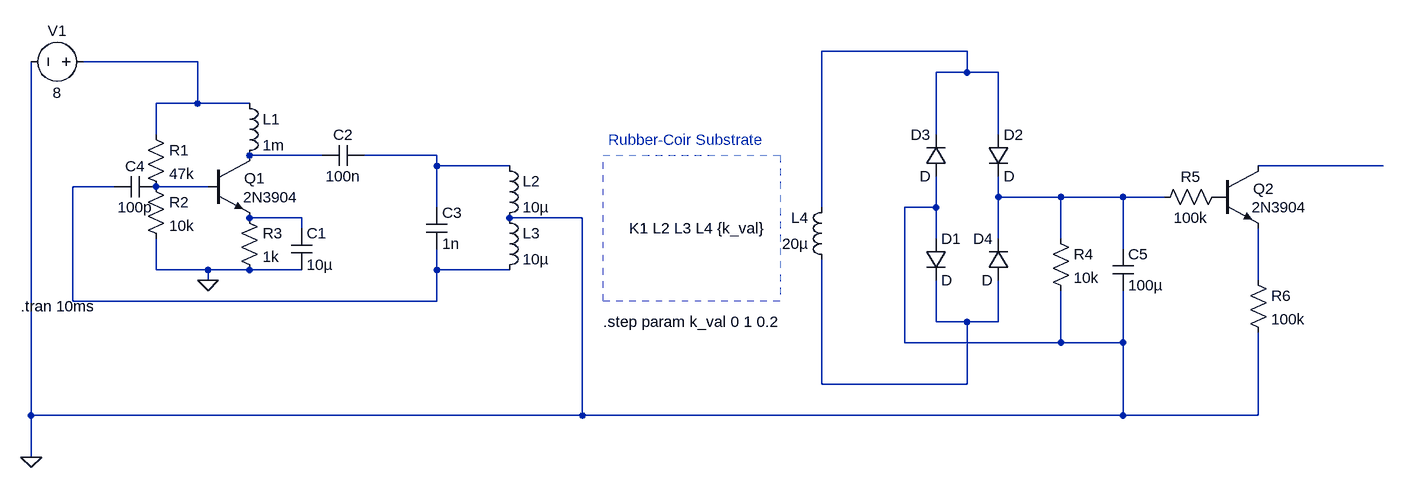
[diagram p0: schematic ecometa_bridge rect.asc]
ecometa_bridge rect.asc, the LTspice schematic file:
Version 4.1
SHEET 1 1652 680
WIRE 1008 -48 784 -48
WIRE -176 -32 -352 -32
WIRE 1008 -16 1008 -48
WIRE 1008 -16 960 -16
WIRE 1056 -16 1008 -16
WIRE -176 32 -176 -32
WIRE -176 32 -240 32
WIRE -96 32 -176 32
WIRE -240 80 -240 32
WIRE 960 80 960 -16
WIRE 1056 80 1056 -16
WIRE 16 112 -96 112
WIRE 192 112 80 112
WIRE 192 128 192 112
WIRE 304 128 192 128
WIRE 1648 128 1456 128
WIRE -304 160 -368 160
WIRE -160 160 -240 160
WIRE 1056 176 1056 144
WIRE 1152 176 1056 176
WIRE 1248 176 1152 176
WIRE 1312 176 1248 176
WIRE 192 192 192 128
WIRE 784 192 784 -48
WIRE 960 192 960 144
WIRE 960 192 912 192
WIRE -16 208 -96 208
WIRE 416 208 304 208
WIRE -16 224 -16 208
WIRE 960 240 960 192
WIRE 1056 240 1056 176
WIRE 1152 240 1152 176
WIRE 1248 256 1248 176
WIRE -240 288 -240 240
WIRE -160 288 -240 288
WIRE -96 288 -160 288
WIRE -16 288 -96 288
WIRE 192 288 192 256
WIRE 304 288 192 288
WIRE -160 304 -160 288
WIRE 1456 304 1456 224
WIRE -368 336 -368 160
WIRE 192 336 192 288
WIRE 192 336 -368 336
WIRE 960 368 960 304
WIRE 1008 368 960 368
WIRE 1056 368 1056 304
WIRE 1056 368 1008 368
WIRE 912 400 912 192
WIRE 1152 400 1152 320
WIRE 1152 400 912 400
WIRE 1248 400 1248 320
WIRE 1248 400 1152 400
WIRE 784 464 784 272
WIRE 1008 464 1008 368
WIRE 1008 464 784 464
WIRE -432 512 -432 -32
WIRE 416 512 416 208
WIRE 416 512 -432 512
WIRE 1248 512 1248 400
WIRE 1248 512 416 512
WIRE 1456 512 1456 384
WIRE 1456 512 1248 512
WIRE -432 576 -432 512
FLAG -160 304 0
FLAG -432 576 0
SYMBOL npn -160 112 R0
WINDOW 0 56 35 Left 2
WINDOW 3 54 64 Left 2
SYMATTR InstName Q1
SYMATTR Value 2N3904
SYMBOL res -256 64 R0
SYMATTR InstName R1
SYMATTR Value 47k
SYMBOL res -256 144 R0
SYMATTR InstName R2
SYMATTR Value 10k
SYMBOL res -112 192 R0
SYMATTR InstName R3
SYMATTR Value 1k
SYMBOL ind -112 16 R0
SYMATTR InstName L1
SYMATTR Value 1m
SYMATTR SpiceLine Rser=1m
SYMBOL cap -32 224 R0
SYMATTR InstName C1
SYMATTR Value 10µ
SYMBOL cap 80 96 R90
WINDOW 0 0 32 VBottom 2
WINDOW 3 32 32 VTop 2
SYMATTR InstName C2
SYMATTR Value 100n
SYMBOL cap 176 192 R0
SYMATTR InstName C3
SYMATTR Value 1n
SYMBOL ind 288 112 R0
SYMATTR InstName L2
SYMATTR Value 10µ
SYMATTR SpiceLine Rser=1m
SYMATTR Type ind
SYMBOL ind 288 192 R0
SYMATTR InstName L3
SYMATTR Value 10µ
SYMATTR SpiceLine Rser=1m
SYMATTR Type ind
SYMBOL cap -240 144 R90
WINDOW 0 0 32 VBottom 2
WINDOW 3 32 32 VTop 2
SYMATTR InstName C4
SYMATTR Value 100p
SYMBOL voltage -336 -32 R90
WINDOW 0 -32 56 VBottom 2
WINDOW 3 32 56 VTop 2
WINDOW 123 0 0 Left 0
WINDOW 39 0 0 Left 0
SYMATTR InstName V1
SYMATTR Value 8
SYMBOL diode 944 240 R0
SYMATTR InstName D1
SYMBOL diode 1040 80 R0
SYMATTR InstName D2
SYMBOL diode 976 144 R180
WINDOW 0 24 64 Left 2
WINDOW 3 24 0 Left 2
SYMATTR InstName D3
SYMBOL diode 1072 304 R180
WINDOW 0 24 64 Left 2
WINDOW 3 24 0 Left 2
SYMATTR InstName D4
SYMBOL res 1136 224 R0
SYMATTR InstName R4
SYMATTR Value 10k
SYMBOL ind 800 288 R180
WINDOW 0 36 80 Left 2
WINDOW 3 36 40 Left 2
SYMATTR InstName L4
SYMATTR Value 20µ
SYMATTR Type ind
SYMATTR SpiceLine Rser=1m
SYMBOL cap 1232 256 R0
SYMATTR InstName C5
SYMATTR Value 100µ
SYMBOL res 1408 160 R90
WINDOW 0 0 56 VBottom 2
WINDOW 3 32 56 VTop 2
SYMATTR InstName R5
SYMATTR Value 100k
SYMBOL npn 1392 128 R0
WINDOW 0 56 35 Left 2
WINDOW 3 54 64 Left 2
SYMATTR InstName Q2
SYMATTR Value 2N3904
SYMBOL res 1440 288 R0
SYMATTR InstName R6
SYMATTR Value 100k
TEXT -448 344 Left 2 !.tran 10ms
TEXT 488 224 Left 2 !K1 L2 L3 L4 {k_val}
TEXT 456 88 Left 2 ;Rubber-Coir Substrate
TEXT 448 368 Left 2 !.step param k_val 0 1 0.2
RECTANGLE Normal 720 336 448 112 2

The netlist it stands for:
* ecometa_bridge rect.asc
Q1 N003 N007 N009 0 2N3904
R1 N002 N007 47k
R2 N007 0 10k
R3 N009 0 1k
L1 N002 N003 1m Rser=1m
C1 N009 0 10µ
C2 N004 N003 100n
C3 N004 N006 1n
L2 N004 0 10µ Rser=1m
L3 0 N006 10µ Rser=1m
C4 N007 N006 100p
V1 N002 0 8
D1 0 N011 D
D2 N001 N008 D
D3 0 N001 D
D4 N011 N008 D
R4 N008 0 10k
L4 N011 N001 20µ Rser=1m
C5 N008 0 100µ
R5 P001 N008 100k
Q2 N005 P001 N010 0 2N3904
R6 N010 0 100k
.model D D
.lib standard.dio
.model NPN NPN
.model PNP PNP
.lib standard.bjt
.tran 10ms
K1 L2 L3 L4 {k_val}
* Rubber-Coir Substrate
.step param k_val 0 1 0.2
.backanno
.end